# EAGLE design pripravekV2 (EAGLE 7.2.0)
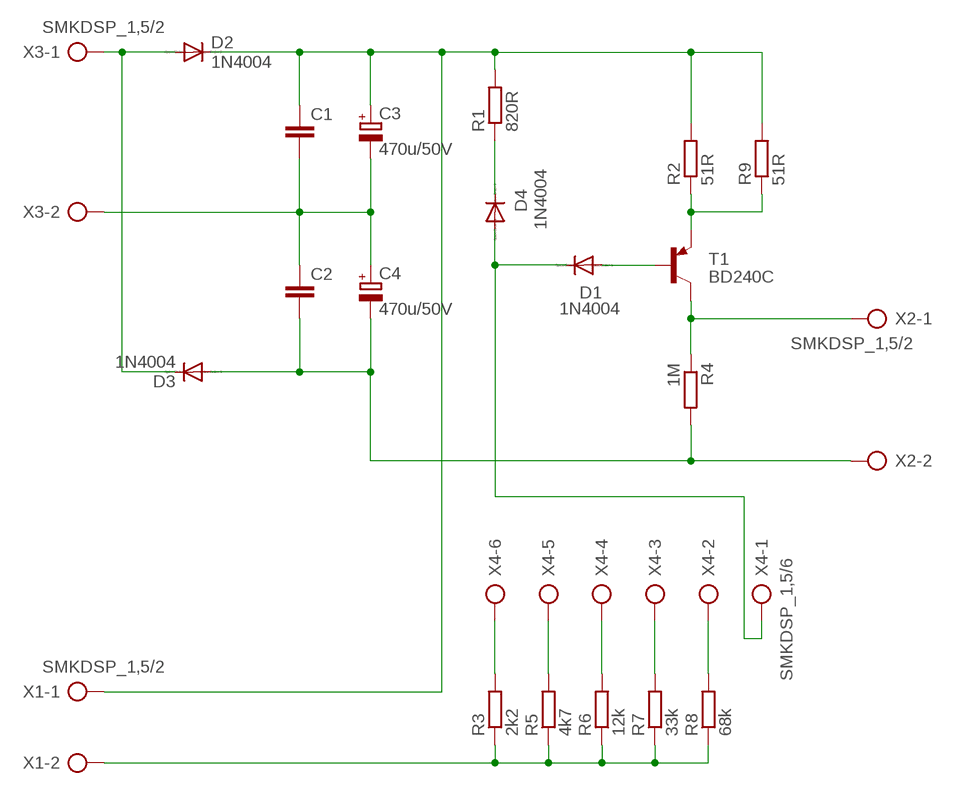
[diagram p0: schematic, sheet 1]

## Parts
C1  C-EU050-035X075  [C050-035X075]
C2  C-EU050-035X075  [C050-035X075]
C3  470u/50V  CPOL-EUE5-13  [E5-13]
C4  470u/50V  CPOL-EUE5-13  [E5-13]
D1  1N4004  [DO41-10]
D2  1N4004  [DO41-10]
D3  1N4004  [DO41-10]
D4  1N4004  [DO41-10]
R1  820R  R-EU_0817/22  [P0817/22]
R2  51R  R-EU_0817/22  [P0817/22]
R3  2k2  R-EU_0817/22  [P0817/22]
R4  1M  R-EU_0207/12  [0207/12]
R5  4k7  R-EU_0817/22  [P0817/22]
R6  12k  R-EU_0817/22  [P0817/22]
R7  33k  R-EU_0817/22  [P0817/22]
R8  68k  R-EU_0817/22  [P0817/22]
R9  51R  R-EU_0817/22  [P0817/22]
T1  BD240C  -PNP-TO220  [TO220]
X1  SMKDSP_1,5/2  [SMKDSP_1,5/2]
X2  SMKDSP_1,5/2  [SMKDSP_1,5/2]
X3  SMKDSP_1,5/2  [SMKDSP_1,5/2]
X4  SMKDSP_1,5/6  [SMKDSP_1,5/6]

## Nets
BASE: D1.A T1.1(B)
COLECTOR: R4.1 T1.2(C) X2.1
EMITTER: R2.1 R9.1 T1.3(E)
M0: C1.2 C2.1 C3.- C4.+ X3.2
N$2: R3.2 X4.6
N$3: R5.2 X4.5
N$4: D1.C D4.A X4.1
N$5: R6.2 X4.4
N$6: R7.2 X4.3
N$7: D2.A D3.C X3.1
N$8: R8.2 X4.2
N$9: D4.C R1.1
N$10: R3.1 R5.1 R6.1 R7.1 R8.1 X1.2
V+: C1.1 C3.+ D2.C R1.2 R2.2 R9.2 X1.1
V-: C2.2 C4.- D3.A R4.2 X2.2

## Library data of the parts
C1 C2 = rcl:C-EU: CAPACITOR, European symbol
C3 C4 = rcl:CPOL-EU: POLARIZED CAPACITOR, European symbol
D1-D4 = diode:1N4004: DIODE general purpose rectifier, 1 A
R1-R9 = rcl:R-EU_: RESISTOR, European symbol
T1 = transistor:*-PNP-: PNP Transistror
X1-X3 = con-phoenix-smkdsp:SMKDSP_1,5/2: Printklemme, Nennstrom: 17,5 A, Bemessungsspannung: 250 V, Raster: 5,0 mm Source: http://eshop.phoenixcontact.de .. 1733415.pdf; MF: FARNELL; MPN: 1733570; OC_FARNELL: 3041244; OC_NEWARK: 69C8588
X4 = con-phoenix-smkdsp:SMKDSP_1,5/6: Printklemme, Nennstrom: 17,5 A, Bemessungsspannung: 250 V, Raster: 5,0 mm Source: http://eshop.phoenixcontact.de .. 1733415.pdf; MF: FARNELL; MPN: 1733619; OC_FARNELL: 3041270; OC_NEWARK: 71C4132

## Board
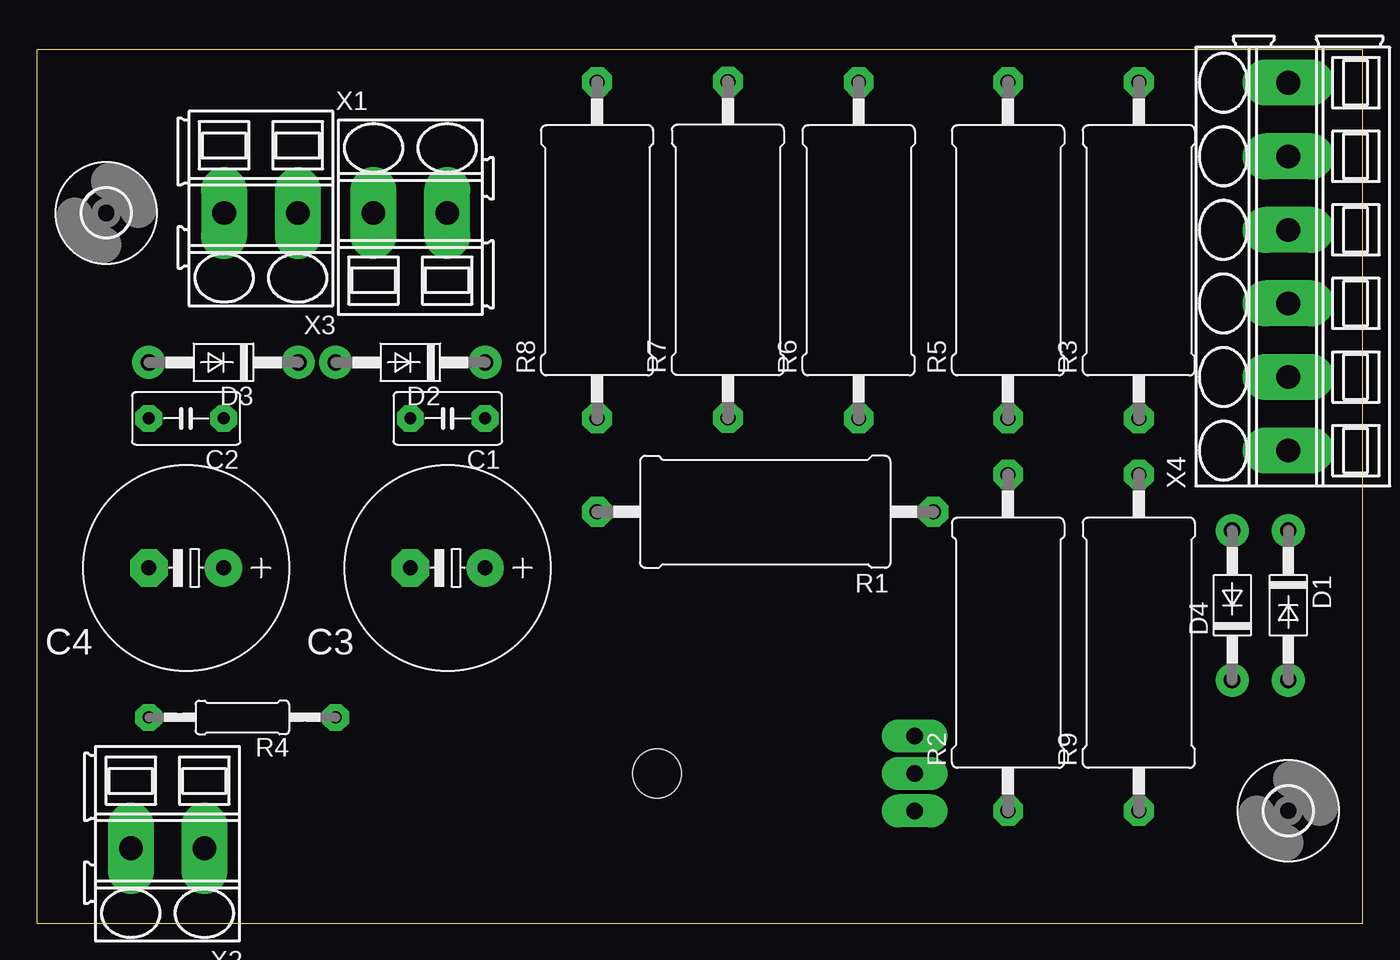
[diagram p1: board, top side]
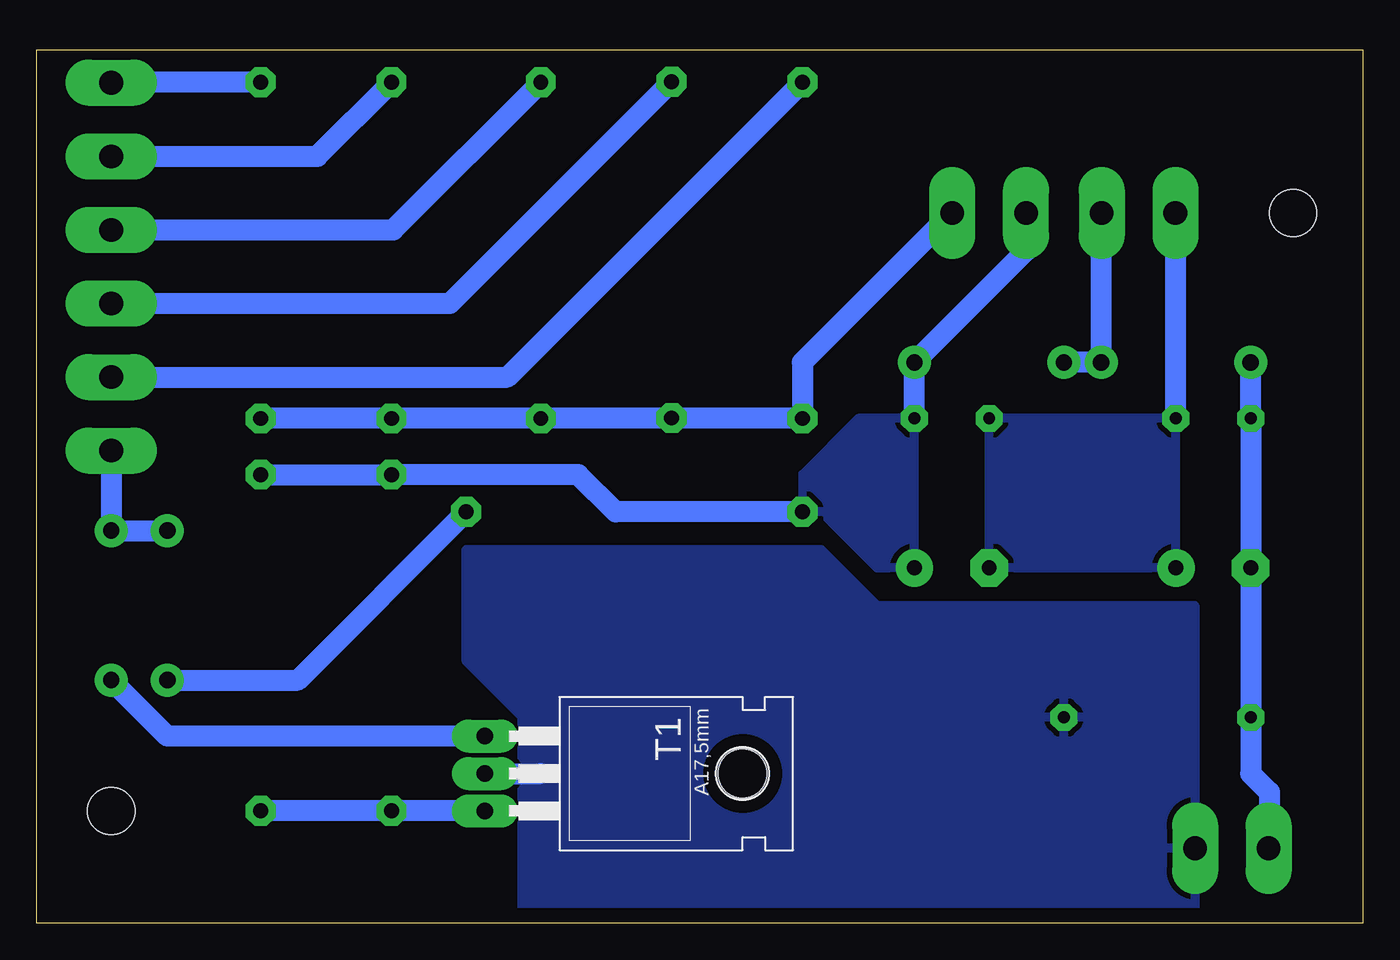
[diagram p2: board, bottom side, seen from below]

Size 90.15 x 59.36 mm. Coordinates in mm from the lower left corner, seen from the top.
Outline: 0,0 90.15,0 90.15,59.36 0,59.36 0,0
Copper layers (1*16): Top 0.035mm / dielectric 1.5mm / Bottom 0.035mm
Design rules "default *": minimum track width 10mil, minimum drill 24mil, track to track 8mil, track to pad 8mil, pad to pad 8mil, via to via 8mil, smd to smd 8mil, copper to edge 40mil, drill to drill 8mil, minimum pad ring 20mil, minimum via ring 8mil, stop-mask expansion 4mil, vias tented up to drill 0mil, thermal gap 15mil

### Footprints (pad centres in the part's own frame; a part is rotated, then mirrored left to right if it is on the bottom)
C050-035X075 = drill 0.813 octagon: 1 -2.54,0; 2 2.54,0
E5-13 = drill 1.016 pad 2.54: + -2.54,0 | drill 1.016 pad 2.54 octagon: - 2.54,0
DO41-10 = drill 1.118: A 5.08,0; C -5.08,0
P0817/22 = drill 1.016 octagon: 1 -11.43,0; 2 11.43,0
0207/12 = drill 0.813 octagon: 1 -6.35,0; 2 6.35,0
TO220 = drill 1.118 long: 1 -2.54,-6.35; 2 0,-6.35; 3 2.54,-6.35 | hole 3.302: 0,11.176
3,2 = hole 3.2: 0,0
SMKDSP_1,5/2 = drill 1.6 pad 1.8 long: 1 -2.5,0; 2 2.5,0
SMKDSP_1,5/6 = drill 1.6 pad 1.8 long: 1 -2.5,0; 2 2.5,0; 3 7.5,0; 4 12.5,0; 5 17.5,0; 6 22.5,0

### Placement (x,y rotation side)
C1  27.94,34.29 180 top
C2  10.16,34.29 180 top
C3  27.94,24.13 180 top
C4  10.16,24.13 180 top
D1  85.09,21.59 270 top
D2  25.4,38.1 180 top
D3  12.7,38.1 180 top
D4  81.28,21.59 90 top
R1  49.53,27.94 180 top
R2  66.04,19.05 90 top
R3  74.93,45.72 90 top
R4  13.97,13.97 180 top
R5  66.04,45.72 90 top
R6  55.88,45.72 90 top
R7  46.99,45.75 90 top
R8  38.1,45.72 90 top
R9  74.93,19.05 90 top
T1  53.34,10.16 270 bottom
U$2  [3,2]  85.09,7.62 0 top
U$3  [3,2]  4.73,48.26 0 top
X1  25.4,48.26 0 top
X2  8.89,5.08 180 top
X3  15.24,48.26 180 top
X4  85.09,34.61 90 top

### Tracks (layer width: path | path; a pad name or v marks a point on that pad's centre or on a via)
BASE
  Bottom 1.422: T1.1 81.28,12.7 D1.A
COLECTOR
  Bottom 1.422: T1.2 55.88,10.16
  pour Bottom: 11.43,21.59 11.43,0 57.15,0 57.15,13.97 60.96,17.78 60.96,25.4 36.83,25.4 33.02,21.59
EMITTER
  Bottom 1.422: T1.3 R2.1 R9.1
M0
  Bottom 1.422: C2.1 12.7,48.22 X3.2
  pour Bottom: 12.7,34.29 25.4,34.29 25.4,24.13 12.7,24.13
N$2
  Bottom 1.422: R3.2 85.05,57.15 X4.6
N$3
  Bottom 1.422: X4.5 71.08,52.11 R5.2
N$4
  Bottom 1.422: X4.1 D1.C D4.A
N$5
  Bottom 1.422: X4.4 65.92,47.11 R6.2
N$6
  Bottom 1.422: X4.3 62.06,42.11 R7.2
N$7
  Bottom 1.422: D2.A D3.C 17.78,48.22 X3.1
N$8
  Bottom 1.422: X4.2 58.14,37.11 R8.2
N$9
  Bottom 1.422: D4.C 72.39,16.51 R1.1
N$10
  Bottom 1.422: R3.1 R5.1 R6.1 55.85,34.32 R7.1 46.96,34.29 R8.1 38.1,38.1 27.94,48.26 X1.2
V+
  Bottom 1.422: C1.1 D2.C 22.86,45.72 22.86,48.22 X1.1 | R9.2 R2.2 53.34,30.48 50.8,27.94 R1.2
  pour Bottom: 30.48,24.13 30.48,34.29 34.29,34.29 38.1,30.48 38.1,27.94 36.83,27.94 33.02,24.13
V-
  Bottom 1.422: D3.A C2.2 C4.- R4.2 7.62,10.16 6.35,8.89 6.35,5.12 X2.2